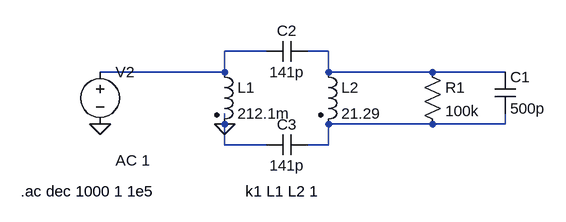
[diagram p0: schematic transformer_impedance_transformation.asc]
transformer_impedance_transformation.asc, the LTspice schematic file:
Version 4
SHEET 1 880 680
WIRE 224 48 160 48
WIRE 320 48 288 48
WIRE 160 80 160 48
WIRE 160 80 -32 80
WIRE 320 80 320 48
WIRE 480 80 320 80
WIRE 592 80 480 80
WIRE 160 160 160 144
WIRE 480 160 320 160
WIRE 592 160 592 144
WIRE 592 160 480 160
WIRE 160 192 160 160
WIRE 224 192 160 192
WIRE 320 192 320 160
WIRE 320 192 288 192
FLAG -32 160 0
FLAG 160 160 0
SYMBOL ind2 144 64 R0
SYMATTR InstName L1
SYMATTR Value 212.1m
SYMATTR Type ind
SYMATTR SpiceLine Rser=1.6
SYMBOL ind2 304 64 R0
SYMATTR InstName L2
SYMATTR Value 21.29
SYMATTR Type ind
SYMATTR SpiceLine Rser=128
SYMBOL res 464 64 R0
SYMATTR InstName R1
SYMATTR Value 100k
SYMBOL voltage -32 64 R0
WINDOW 123 24 152 Left 2
WINDOW 39 24 124 Left 2
SYMATTR InstName V2
SYMATTR Value ""
SYMATTR Value2 AC 1
SYMBOL cap 576 80 R0
SYMATTR InstName C1
SYMATTR Value 500p
SYMBOL cap 288 32 R90
WINDOW 0 0 32 VBottom 2
WINDOW 3 32 32 VTop 2
SYMATTR InstName C2
SYMATTR Value 141p
SYMBOL cap 288 176 R90
WINDOW 0 0 32 VBottom 2
WINDOW 3 32 32 VTop 2
SYMATTR InstName C3
SYMATTR Value 141p
TEXT 192 264 Left 2 !k1 L1 L2 1
TEXT -154 264 Left 2 !.ac dec 1000 1 1e5

The netlist it stands for:
* transformer_impedance_transformation.asc
L1 N001 0 212.1m Rser=1.6
L2 N002 N003 21.29 Rser=128
R1 N002 N003 100k
V2 N001 0 AC 1
C1 N002 N003 500p
C2 N002 N001 141p
C3 N003 0 141p
k1 L1 L2 1
.ac dec 1000 1 1e5
.backanno
.end